# EAGLE design RobotLEDBoard (EAGLE 7.1.0)
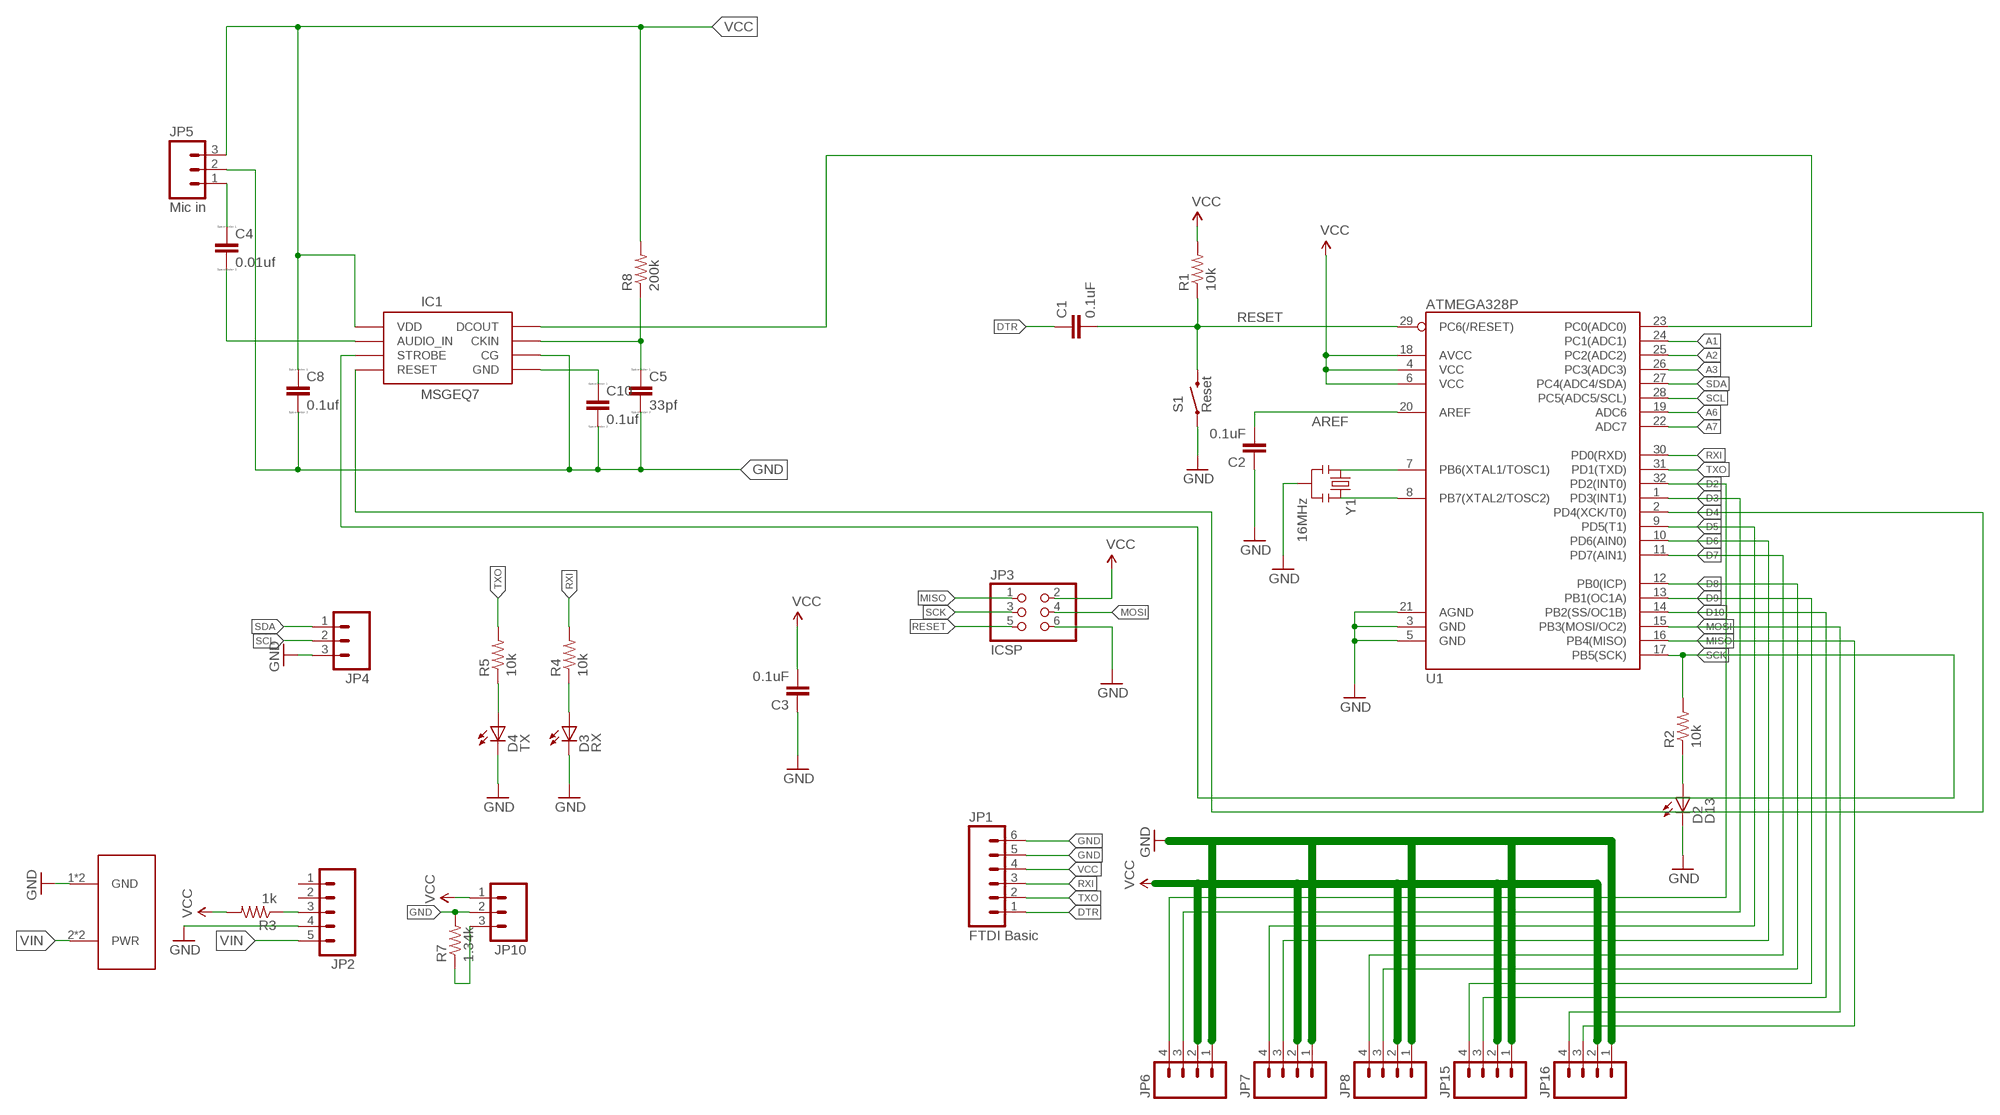
[diagram p0: schematic, sheet 1]

## Parts
C1  0.1uF  CAP0603-CAP  [0603-CAP]
C2  0.1uF  CAP0603-CAP  [0603-CAP]
C3  0.1uF  CAP0603-CAP  [0603-CAP]
C4  0.01uf  CC0402  [C0402]
C5  33pf  CC0201  [C0201]
C8  0.1uf  CC0603  [C0603]
C10  0.1uf  CC0603  [C0603]
D2  D13  LED-RED0603  [LED-0603]
D3  RX  LED-GREEN0603  [LED-0603]
D4  TX  LED-RED0603  [LED-0603]
IC1  MSGEQ7  [DIP08]
JP1  FTDI Basic  M06SIP  [1X06]
JP2  M05PTH  [1X05]
JP3  ICSP  PINHD-2X3  [2X03]
JP4  M03PTH  [1X03]
JP5  Mic in  M03PTH  [1X03]
JP6  M04PTH  [1X04]
JP7  M04PTH  [1X04]
JP8  M04PTH  [1X04]
JP10  M03PTH  [1X03]
JP15  M04PTH  [1X04]
JP16  M04PTH  [1X04]
R1  10k  RESISTOR0603-RES  [0603-RES]
R2  10k  RESISTOR0603-RES  [0603-RES]
R3  1k  RESISTORAXIAL-0.3  [AXIAL-0.3]
R4  10k  RESISTOR0603-RES  [0603-RES]
R5  10k  RESISTOR0603-RES  [0603-RES]
R7  1.34k  RESISTORAXIAL-0.3  [AXIAL-0.3]
R8  200k  R-US_M1206  [M1206]
S1  Reset  SWITCH-MOMENTARY-2SMD  [TACTILE_SWITCH_SMD]
U1  ATMEGA328P  ATMEGA328_SMT  [TQFP32-08]
U$1  LSF-SMT  [LSF-SMT]
Y1  16MHz  RESONATOR16MHZ  [RESONATOR-SMD]

## Nets
A0: IC1.3(DCOUT) U1.23(PC0(ADC0))
A1: U1.24(PC1(ADC1))
A2: U1.25(PC2(ADC2))
A3: U1.26(PC3(ADC3))
A6: U1.19(ADC6)
A7: U1.22(ADC7)
AREF: C2.2 U1.20(AREF)
D2: JP6.4 U1.32(PD2(INT0))
D3: JP6.3 U1.1(PD3(INT1))
D4: IC1.7(RESET) U1.2(PD4(XCK/T0))
D5: JP7.4 U1.9(PD5(T1))
D6: JP7.3 U1.10(PD6(AIN0))
D7: JP8.4 U1.11(PD7(AIN1))
D8: JP8.3 U1.12(PB0(ICP))
D9: JP15.4
D10: JP15.3 U1.14(PB2(SS/OC1B))
DTR: C1.1 JP1.1
GND: C2.1 C3.1 C5.2 C8.2 C10.2 D2.C D3.C D4.C IC1.2(CG) JP1.5 JP1.6 JP2.4 JP3.6 JP4.3 JP5.2 JP6.1 JP7.1 JP8.1 JP10.2 JP15.1 JP16.1 R7.P$2 S1.1 U1.3(GND) U1.5(GND) U1.21(AGND) U$1.1(GND) U$1.1-2(GND) Y1.2
MISO: JP3.1 JP16.3 U1.16(PB4(MISO))
MOSI: JP3.4 JP16.4 U1.15(PB3(MOSI/OC2))
N$1: U1.7(PB6(XTAL1/TOSC1)) Y1.1
N$2: U1.8(PB7(XTAL2/TOSC2)) Y1.3
N$3: JP2.3 R3.P$1
N$4: D2.A R2.1
N$5: D3.A R4.1
N$6: D4.A R5.1
N$8: U1.13(PB1(OC1A))
N$9: JP10.3 R7.P$1
N$15: C5.1 IC1.8(CKIN) R8.1
N$16: C4.1 JP5.1
N$17: C4.2 IC1.5(AUDIO_IN)
N$18: C10.1 IC1.6(GND)
RESET: C1.2 JP3.5 R1.1 S1.3 U1.29(PC6(/RESET))
RXI: JP1.3 R4.2 U1.30(PD0(RXD))
SCK: IC1.4(STROBE) JP3.3 R2.2 U1.17(PB5(SCK))
SCL: JP4.2 U1.28(PC5(ADC5/SCL))
SDA: JP4.1 U1.27(PC4(ADC4/SDA))
TXO: JP1.2 R5.2 U1.31(PD1(TXD))
VCC: C3.2 C8.1 IC1.1(VDD) JP1.4 JP3.2 JP5.3 JP6.2 JP7.2 JP8.2 JP10.1 JP15.2 JP16.2 R1.2 R3.P$2 R8.2 U1.4(VCC) U1.6(VCC) U1.18(AVCC)
VIN: JP2.5 U$1.2(PWR) U$1.2-2(PWR)
Unconnected: JP2.1 JP2.2

## Library data of the parts
C1-C3 = SparkFun-Passives:CAP: Capacitor Standard 0603 ceramic capacitor, and 0.1" leaded capacitor.
C4 C5 C8 C10 = eagle-ltspice:C: CAPACITOR, European symbol; SPICEMODEL: NONE; SPICEPREFIX: C
D2 D4 = SparkFun-LED:LED-RED: Assorted Red LEDs LilyPad 1206- DIO-09912 1206- DIO-00809 0603- DIO-00819; PROD_ID: DIO-00819; VALUE: RED
D3 = SparkFun-LED:LED-GREEN: Various green LEDs Green LEDs used in SFE Production 0603- DIO-00821 LARGE- DIO-00862 LILYPAD- DIO-09910; PROD_ID: DIO-00821; VALUE: GREEN
IC1 = SparkFun-AnalogIC:MSGEQ7: 7-band graphic equalizer
JP1 = SparkFun-Connectors:M06: Header 6 Standard 6-pin 0.1" header. Use with straight break away headers (SKU : PRT-00116), right angle break away headers (PRT-00553), swiss pins (PRT-00743), machine pins (PRT-00117), and female headers (PRT-00115). Molex polarized connector foot print use with SKU : PRT-08094 with associated crimp pins and housings. NOTES ON THE VARIANTS LOCK and LOCK_LONGPADS... This footprint was designed to help hold the alignment of a through-hole component (i.e. 6-pin header) while soldering it into place. You may notice that each hole has been shifted either up or down by 0.005 of an inch from it's more standard position (which is a perfectly straight line). This slight alteration caused the pins (the squares in the middle) to touch the edges of the holes. Because they are alternating, it causes a "brace" to hold the component in place. 0.005 has proven to be the perfect amount of "off-center" position when using our standard breakaway headers. Although looks a little odd when you look at the bare footprint, once you have a header in there, the alteration is very hard to notice. Also,if you push a header all the way into place, it is covered up entirely on the bottom side. This idea of altering the position of holes to aid alignment will be further integrated into the Sparkfun Library for other footprints. It can help hold any component with 3 or more connection pins.
JP2 = SparkFun-Connectors:M05: Header 5 Standard 5-pin 0.1" header. Use with straight break away headers (SKU : PRT-00116), right angle break away headers (PRT-00553), swiss pins (PRT-00743), machine pins (PRT-00117), and female headers (PRT-00115). Molex polarized connector foot print use with SKU : PRT-08230 with associated crimp pins and housings.
JP3 = SparkFun-Connectors:PINHD-2X3: PIN HEADER
JP4 JP5 JP10 = SparkFun-Connectors:M03: Header 3 Standard 3-pin 0.1" header. Use with straight break away headers (SKU : PRT-00116), right angle break away headers (PRT-00553), swiss pins (PRT-00743), machine pins (PRT-00117), and female headers (PRT-00115). Molex polarized connector foot print use with SKU : PRT-08232 with associated crimp pins and housings.
JP6-JP8 JP15 JP16 = SparkFun-Connectors:M04: Header 4 Standard 4-pin 0.1" header. Use with straight break away headers (SKU : PRT-00116), right angle break away headers (PRT-00553), swiss pins (PRT-00743), machine pins (PRT-00117), and female headers (PRT-00115). Molex polarized connector foot print use with SKU : PRT-08231 with associated crimp pins and housings. 1MM SMD Version SKU: PRT-10208
R1 R2 R4 R5 = SparkFun-Passives:RESISTOR: Resistor Basic schematic elements and footprints for 0603, 1206, and PTH resistors.
R3 R7 = SparkFun-Resistors:RESISTOR: Resistor Basic schematic elements and footprints for 0603, 1206, and PTH resistors.
R8 = rcl:R-US_: RESISTOR, American symbol
S1 = SparkFun-Electromechanical:SWITCH-MOMENTARY-2: Various NO switches- pushbuttons, reed, etc; PROD_ID: SWCH-08247
U1 = SparkFun-DigitalIC:ATMEGA328_SMT: 32-Pin Atmega328 part Commonly used on Arduino compatible boards Available in QFP and QFN packages TQFP is IC-09069 QFN is non-stock; PROD_ID: IC-09069
U$1 = LSF-SMT:LSF-SMT
Y1 = SparkFun-FreqCtrl:RESONATOR: Resonator Small SMD resonator. Used, eg, on the Arduino Pro/ Pro Mini boards. 8MHz- XTAL-08895 16MHz- XTAL-08900; PROD_ID: XTAL-08900

## Board
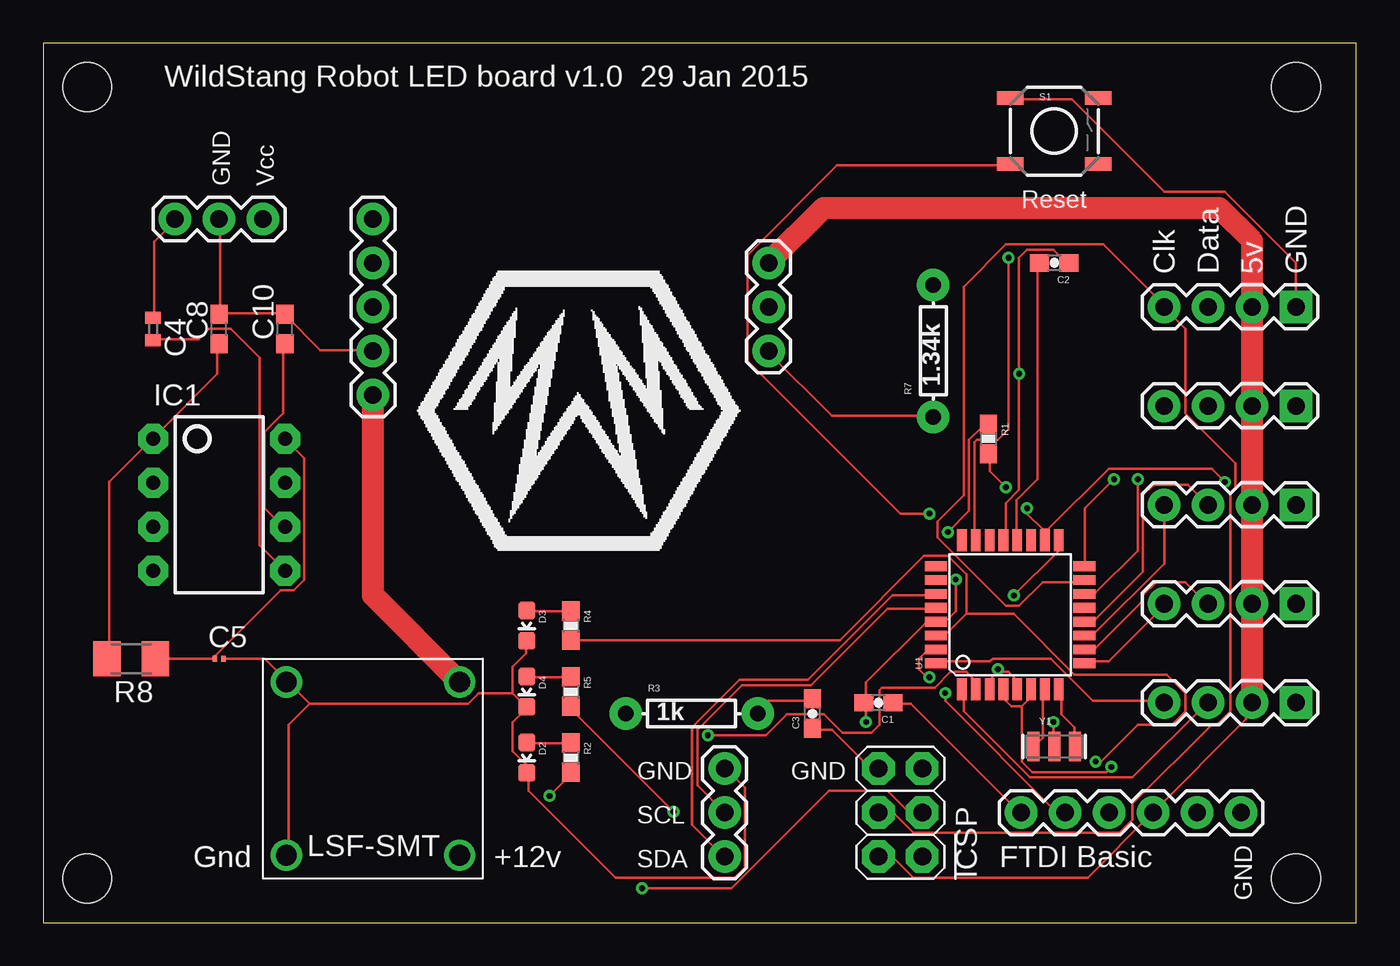
[diagram p1: board, top side]
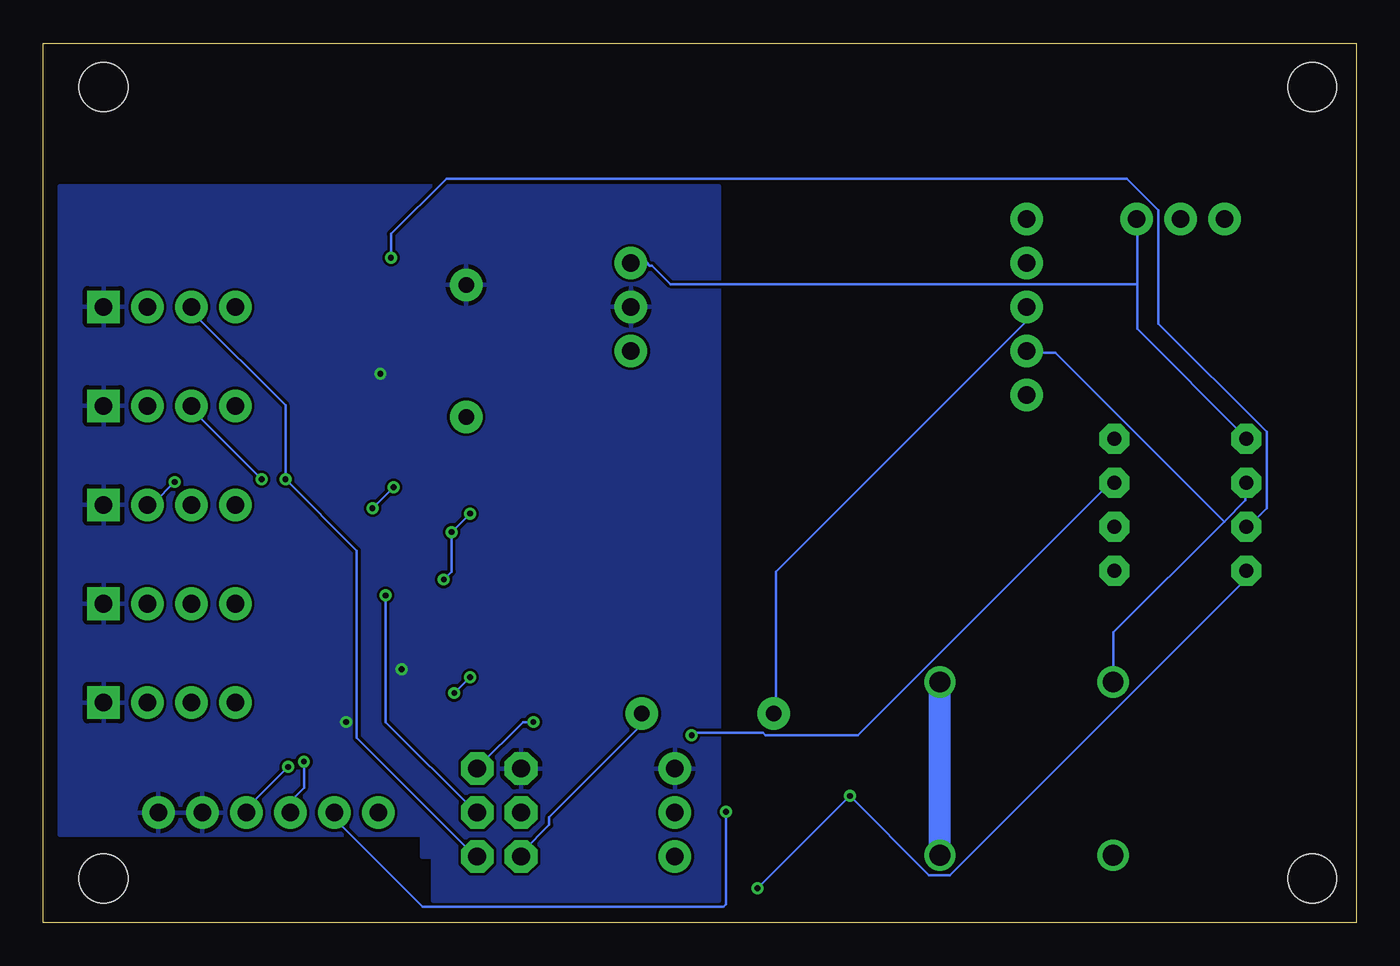
[diagram p2: board, bottom side, seen from below]

Size 75.87 x 50.79 mm. Coordinates in mm from the lower left corner, seen from the top.
Outline: 0,0 75.87,0 75.87,50.79 0,50.79 0,0
Copper layers (1*16): Top 0.0356mm / dielectric 1.5011mm / Bottom 0.0356mm
Design rules "LaenPCBOrder": minimum track width 6mil, minimum drill 13mil, track to track 6mil, track to pad 6mil, pad to pad 6mil, via to via 6mil, smd to smd 6mil, copper to edge 15mil, drill to drill 6mil, minimum pad ring 7mil, minimum via ring 7mil, stop-mask expansion 3mil, vias tented up to drill 0mil, thermal gap 10mil
Holes 2.8 mm at 2.54,2.54 2.54,48.26 72.39,48.26 72.39,2.54

### Footprints (pad centres in the part's own frame; a part is rotated, then mirrored left to right if it is on the bottom)
0603-CAP = smd 1.1 x 1: 1 -0.85,0; 2 0.85,0
C0402 = smd 0.7 x 0.9: 1 -0.65,0; 2 0.65,0
C0201 = smd 0.25 x 0.35: 1 -0.25,0; 2 0.25,0
C0603 = smd 1.1 x 1: 1 -0.85,0; 2 0.85,0
LED-0603 = smd 1 x 1: A 0,-0.877; C 0,0.877
DIP08 = drill 0.813 pad 1.727 octagon: 1 -3.81,-3.81; 2 -1.27,-3.81; 3 1.27,-3.81; 4 3.81,-3.81; 5 3.81,3.81; 6 1.27,3.81; 7 -1.27,3.81; 8 -3.81,3.81
1X06 = drill 1.016 pad 1.88: 1 0,0; 2 2.54,0; 3 5.08,0; 4 7.62,0; 5 10.16,0; 6 12.7,0
1X05 = drill 1.016 pad 1.88: 1 0,0; 2 2.54,0; 3 5.08,0; 4 7.62,0; 5 10.16,0
2X03 = drill 1.016 pad 1.88 octagon: 1 -2.54,-1.27; 2 -2.54,1.27; 3 0,-1.27; 4 0,1.27; 5 2.54,-1.27; 6 2.54,1.27
1X03 = drill 1.016 pad 1.88: 1 0,0; 2 2.54,0; 3 5.08,0
1X04 = drill 1.016 pad 1.88 square: 1 0,0 | drill 1.016 pad 1.88: 2 2.54,0; 3 5.08,0; 4 7.62,0
0603-RES = smd 1.1 x 1: 1 -0.85,0; 2 0.85,0
AXIAL-0.3 = drill 0.9 pad 1.88: P$1 -3.81,0; P$2 3.81,0
M1206 = smd 1.6 x 2: 1 -1.4,0; 2 1.4,0
TACTILE_SWITCH_SMD = smd 1.524 x 0.762: 1 -2.54,1.905; 2 2.54,1.905; 3 -2.54,-1.905; 4 2.54,-1.905
TQFP32-08 = smd 1.27 x 0.559: 1 -4.293,2.8; 2 -4.293,2; 3 -4.293,1.2; 4 -4.293,0.4; 5 -4.293,-0.4; 6 -4.293,-1.2; 7 -4.293,-2; 8 -4.293,-2.8; 17 4.293,-2.8; 18 4.293,-2; 19 4.293,-1.2; 20 4.293,-0.4; 21 4.293,0.4; 22 4.293,1.2; 23 4.293,2; 24 4.293,2.8 | smd 0.559 x 1.27: 9 -2.8,-4.293; 10 -2,-4.293; 11 -1.2,-4.293; 12 -0.4,-4.293; 13 0.4,-4.293; 14 1.2,-4.293; 15 2,-4.293; 16 2.8,-4.293; 25 2.8,4.293; 26 2,4.293; 27 1.2,4.293; 28 0.4,4.293; 29 -0.4,4.293; 30 -1.2,4.293; 31 -2,4.293; 32 -2.8,4.293
LSF-SMT = drill 1.199: 1 -5.004,5.004; 1-2 -5.004,-5.004; 2 5.004,5.004; 2-2 5.004,-5.004
RESONATOR-SMD = smd 0.7 x 1.7: 1 -1.2,0; 2 0,0; 3 1.2,0

### Placement (x,y rotation side)
C1  48.26,12.7 180 top
C2  58.42,38.1 180 top
C3  44.45,12.06 90 top
C4  6.35,34.29 270 top
C5  10.16,15.24 0 top
C8  10.16,34.29 90 top
C10  13.97,34.29 90 top
D2  27.94,9.53 180 top
D3  27.94,17.14 180 top
D4  27.94,13.34 180 top
IC1  10.16,24.13 270 top
JP1  56.52,6.35 0 top
JP2  19.05,40.64 270 top
JP3  49.53,6.35 90 top
JP4  39.37,3.81 90 top
JP5  7.62,40.64 0 top
JP6  72.39,12.7 180 top
JP7  72.39,18.41 180 top
JP8  72.39,24.13 180 top
JP10  41.91,38.1 270 top
JP15  72.39,29.84 180 top
JP16  72.39,35.56 180 top
R1  54.61,27.94 270 top
R2  30.48,9.53 270 top
R3  37.47,12.06 0 top
R4  30.48,17.14 270 top
R5  30.48,13.34 270 top
R7  51.44,33.02 90 top
R8  5.08,15.24 180 top
S1  58.42,45.72 0 top
U1  55.88,17.78 90 top
U$1  19.05,8.89 0 top
Y1  58.42,10.16 0 top

### Tracks (layer width: path | path; a pad name or v marks a point on that pad's centre or on a via)
A0  (via drill 0.33)
  Top 0.152: v55.78,38.41 55.78,28.5 55.17,27.89 53.95,27.89 53.8,27.74 53.8,22.1 U1.23
  Bottom 0.152: v55.78,38.41 55.78,39.78 52.58,42.98 13.26,42.98 11.43,41.15 11.43,34.59 5.18,28.35 5.18,23.93 6.25,22.86 IC1.3
AREF
  Top 0.152: C2.2 57.45,38.1 57.45,25.6 56.24,24.38 56.24,22.1 U1.20
D2
  Top 0.152: U1.32 51.66,15.09 54.71,15.09 54.86,15.24 58.22,15.24 60.66,12.8 64.77,12.8 JP6.4
D3
  Top 0.152: U1.1 53.19,13.41 53.19,12.19 57,8.38 62.94,8.38 67.21,12.65 JP6.3
D4  (via drill 0.33)
  Top 0.152: v38.41,10.82 41.76,10.82 42.98,12.04 45.11,12.04 46.18,10.97 47.85,10.97 48.31,11.43 48.31,13.41 48.46,13.56 51.51,13.56 52.43,14.48 53.34,14.48 53.8,14.02 53.8,13.56 U1.2
  Bottom 0.152: v38.41,10.82 38.25,10.97 34.29,10.97 34.14,10.82 28.8,10.82 14.33,25.3 14.02,25.3 IC1.7
D5
  Top 0.152: U1.9 60.2,15.09 61.57,15.09 64.77,18.29 JP7.4
D6
  Top 0.152: U1.10 60.2,15.85 60.81,15.85 63.55,18.59 63.55,18.9 64.31,19.66 65.99,19.66 67.21,18.44 JP7.3
D7
  Top 0.152: JP8.4 64.77,20.73 60.66,16.61 60.2,16.61 U1.11
D8
  Top 0.152: JP8.3 66.14,25.3 64.16,25.3 63.55,24.69 63.55,20.27 60.81,17.53 60.2,17.53 U1.12
D10  (via drill 0.33)
  Top 0.152: v63.25,25.6 63.25,21.49 60.81,19.05 60.2,19.05 U1.14
  Bottom 0.152: v63.25,25.6 67.36,29.72 JP15.3
DTR
  Top 0.152: C1.1 49.23,12.65 50.14,12.65 56.39,6.4 JP1.1
GND  (via drill 0.33)
  Top 0.152: 10.21,35.2 13.87,35.2 C10.2 14.02,35.05 16,33.07 19.05,33.07 JP2.4 | 10.21,35.2 10.21,40.54 JP5.2 | 10.21,35.2 C8.2 | 27.13,13.26 27.13,14.78 27.89,15.54 27.89,16.15 D3.C | 27.13,13.26 27.89,12.5 D4.C 27.89,12.34 27.13,11.58 27.13,9.91 27.89,9.14 27.89,8.69 D2.C 28.04,8.53 28.04,7.62 33.07,2.59 39.93,2.59 40.54,3.2 40.54,7.77 39.47,8.84 JP4.3 | C5.2 12.8,15.24 14.02,14.02 U$1.1 14.17,13.87 15.39,12.65 | 27.13,13.26 25.15,13.26 24.54,12.65 15.39,12.65 | 15.39,12.65 14.17,11.43 14.17,3.96 U$1.1-2 | C2.1 59.13,38.1 58.37,38.86 56.84,38.86 56.39,38.41 v56.39,31.7 56.39,24.99 55.63,24.23 55.63,22.1 U1.21 | 55.17,14.48 54.71,14.02 54.71,13.56 U1.3 | 55.17,14.48 55.78,14.48 56.24,14.02 56.24,13.56 U1.5 | C3.1 44.5,11.12 45.57,11.12 47.7,8.99 48.16,8.99 JP3.6 | JP16.1 72.39,38.1 68.28,42.22 64.77,42.22 59.44,47.55 55.93,47.55 S1.1 | v58.37,11.58 58.37,10.21 Y1.2 | v55.17,14.63 55.17,14.48
  Bottom 0.152: 7.62,23.16 14.02,16.76 14.02,14.02 U$1.1 | 7.62,23.16 6.4,24.38 6.4,25.3 IC1.2 | 7.62,23.16 17.37,32.92 19.05,32.92 JP2.4
  pour Bottom: 74.93,42.55 74.93,5.08 53.98,5.08 53.98,3.81 53.34,3.81 53.34,1.27 36.83,1.27 36.83,42.55
MISO  (via drill 0.33)
  Top 0.152: v61.87,25.6 60.2,23.93 60.2,20.73 U1.16
  Bottom 0.152: JP16.3 67.21,35.51 67.21,35.2 61.87,29.87 v61.87,25.6 57.76,21.49 57.76,10.67 50.9,3.81 JP3.1
MOSI
  Top 0.152: U1.15 60.05,19.66 57.76,19.66 56.39,18.29 55.63,18.29 51.66,22.25 51.66,23.16 53.19,24.69 53.19,36.73 55.63,39.17 61.27,39.17 64.77,35.66 JP16.4 64.77,35.51 65.99,34.29 65.99,29.41 68.89,26.52 68.89,25.15 68.58,24.84 68.58,12.19 67.82,11.43 67.51,11.43 62.94,6.86 62.94,5.94 62.18,5.18 50.29,5.18 49.23,6.25 48.31,6.25 JP3.4
N$1
  Top 0.152: U1.7 57.76,13.41 57.76,10.67 57.3,10.21 Y1.1
N$2
  Top 0.152: U1.8 58.83,13.41 58.83,12.04 59.59,11.28 59.59,10.21 Y1.3
N$3
  Bottom 0.152: JP2.3 19.05,34.75 33.53,20.27 33.53,12.19 R3.P$1
N$4
  Top 0.152: D2.A 28.04,10.36 30.48,10.36 R2.1
N$5
  Top 0.152: D3.A 28.04,17.98 30.48,17.98 R4.1
N$6
  Top 0.152: D4.A 28.04,14.17 30.48,14.17 R5.1
N$9
  Top 0.152: R7.P$1 51.36,29.26 45.57,29.26 41.91,32.92 JP10.3
N$15
  Top 0.152: R8.1 C5.1 | C5.1 9.91,15.39 13.72,19.2 14.48,19.2 15.09,19.81 15.09,26.82 IC1.8 | C5.1
N$16
  Top 0.152: C4.1 6.4,35.05 6.4,39.32 7.62,40.54 JP5.1
N$17
  Top 0.152: IC1.5 12.5,21.79 12.5,32.61 10.82,34.29 9.6,34.29 8.99,33.68 6.4,33.68 C4.2
N$18
  Top 0.152: C10.1 13.87,33.38 13.87,29.41 12.8,28.35 12.8,23.93 13.87,22.86 IC1.6
RESET  (via drill 0.33)
  Top 0.152: v52.27,22.55 53.49,23.77 53.49,27.89 54.25,28.65 54.56,28.65 R1.1 | v52.73,19.81 52.73,17.98 52.27,17.53 51.66,17.53 U1.29 51.51,17.37 51.05,17.37 47.55,13.87 47.55,12.8 C1.2 47.55,12.65 v47.55,11.58 | v51.21,23.62 49.53,23.62 40.69,32.46 40.69,38.56 45.87,43.74 55.78,43.74 S1.3
  Bottom 0.152: v52.73,19.81 52.27,20.27 v52.27,22.55 v51.21,23.62 | v47.55,11.58 48.16,11.58 50.75,8.99 JP3.5
RXI  (via drill 0.33)
  Top 0.152: 53.34,17.83 53.34,20.12 52.27,21.18 50.9,21.18 46.02,16.31 30.48,16.31 R4.2 | 53.34,17.83 52.12,16.61 51.66,16.61 U1.30 | v60.81,9.3 61.11,9.3 63.25,11.43 65.23,11.43 65.99,12.19 65.99,13.26 64.92,14.33 59.59,14.33 56.08,17.83 53.34,17.83
  Bottom 0.152: v60.81,9.3 60.81,7.77 61.57,7.01 61.57,6.4 JP1.3
SCK  (via drill 0.33)
  Top 0.152: v56.08,18.9 58.67,21.49 58.67,21.95 U1.17 | v29.26,7.32 30.48,8.53 R2.2 | v34.59,1.98 39.78,1.98 45.41,7.62 48.77,7.62 49.99,6.4 50.75,6.4 JP3.3
  Bottom 0.152: v56.08,18.9 56.08,11.58 50.9,6.4 JP3.3 | IC1.4 6.4,20.27 6.4,19.81 23.47,2.74 24.69,2.74 v29.26,7.32 v34.59,1.98
SCL
  Top 0.152: JP4.2 37.8,7.92 37.8,11.12 40.39,13.72 44.35,13.72 48.77,18.14 51.51,18.14 U1.28
SDA
  Top 0.152: U1.27 51.51,18.9 49.07,18.9 44.2,14.02 40.23,14.02 37.49,11.28 37.49,5.64 39.32,3.81 JP4.1
TXO  (via drill 0.33)
  Top 0.152: v36.42,6.4 30.48,12.34 R5.2 | v51.21,14.17 51.05,14.17 50.6,14.63 50.6,15.24 51.05,15.7 51.51,15.7 U1.31 | v52.12,13.26 52.12,12.8 58.52,6.4 58.98,6.4 JP1.2
  Bottom 0.152: v36.42,6.4 36.42,1.07 36.58,0.91 53.95,0.91 58.98,5.94 58.98,6.25 JP1.2 | v52.12,13.26 v51.21,14.17
VCC  (via drill 0.33)
  Top 0.152: C8.1 10.06,33.38 10.06,31.7 6.4,28.04 IC1.1 6.25,27.89 3.81,25.45 3.81,15.24 R8.2 | v55.63,25.15 54.71,26.06 54.71,26.98 R1.2 | v56.84,23.93 56.84,23.62 57.76,22.71 | 57.76,22.71 57.76,22.1 U1.18 | JP7.2 69.95,18.44 69.85,18.44 | 69.85,24.23 69.95,24.23 JP8.2 | JP15.2 69.95,29.87 69.85,29.87 | JP16.2 69.95,35.51 69.85,35.51 | 57.76,22.71 58.06,22.71 61.57,26.21 67.51,26.21 v68.28,25.45 | C3.2 44.35,12.8 41.91,12.8 41.3,12.19 R3.P$2 | 56.54,12.5 55.93,12.5 55.63,12.8 55.63,13.41 U1.4 | 56.54,12.5 57,12.95 57,13.41 U1.6 | 56.54,12.5 56.54,9.3 57.15,8.69 61.42,8.69 v61.72,8.99 | JP3.2 49.07,3.81 50.29,2.59 60.35,2.59 64.01,6.25 JP1.4 64.16,6.4 69.49,11.73 69.49,12.19 JP6.2
  Top 1.27: JP6.2 JP7.2 69.85,18.44 JP8.2 69.85,24.23 JP15.2 69.85,29.87 69.85,35.51 JP16.2 69.85,39.37 67.94,41.27 45.09,41.27 JP10.1
  Bottom 0.152: 12.65,36.88 12.65,34.29 6.4,28.04 IC1.1 | 12.65,36.88 12.65,40.54 JP5.3 | v56.84,23.93 v55.63,25.15 | v68.28,25.45 69.49,24.23 69.8,24.23 JP8.2 | v61.72,8.99 64.01,6.71 64.01,6.4 JP1.4 | R3.P$2 41.3,12.04 41.3,11.43 46.63,6.1 46.63,5.64 48.16,4.12 48.16,3.81 JP3.2 | 12.65,36.88 39.62,36.88 40.69,37.95 40.84,37.95 41,38.1 JP10.1
VIN
  Top 1.27: JP2.5 19.05,18.9 U$1.2
  Bottom 0.152: 24.08,3.96 U$1.2-2 | 24.08,13.87 U$1.2
  Bottom 1.27: 24.08,13.87 24.08,3.96

### Text on the board
tPlace: WildStang Robot LED board v1.0 29 Jan 2015 | GND | Vcc | Reset | Clk | Data | 5v | GND | GND | GND | SCL | Gnd | +12v | SDA | GND